# Altium schematic sheet 1_top_sheet.SchDoc
size A
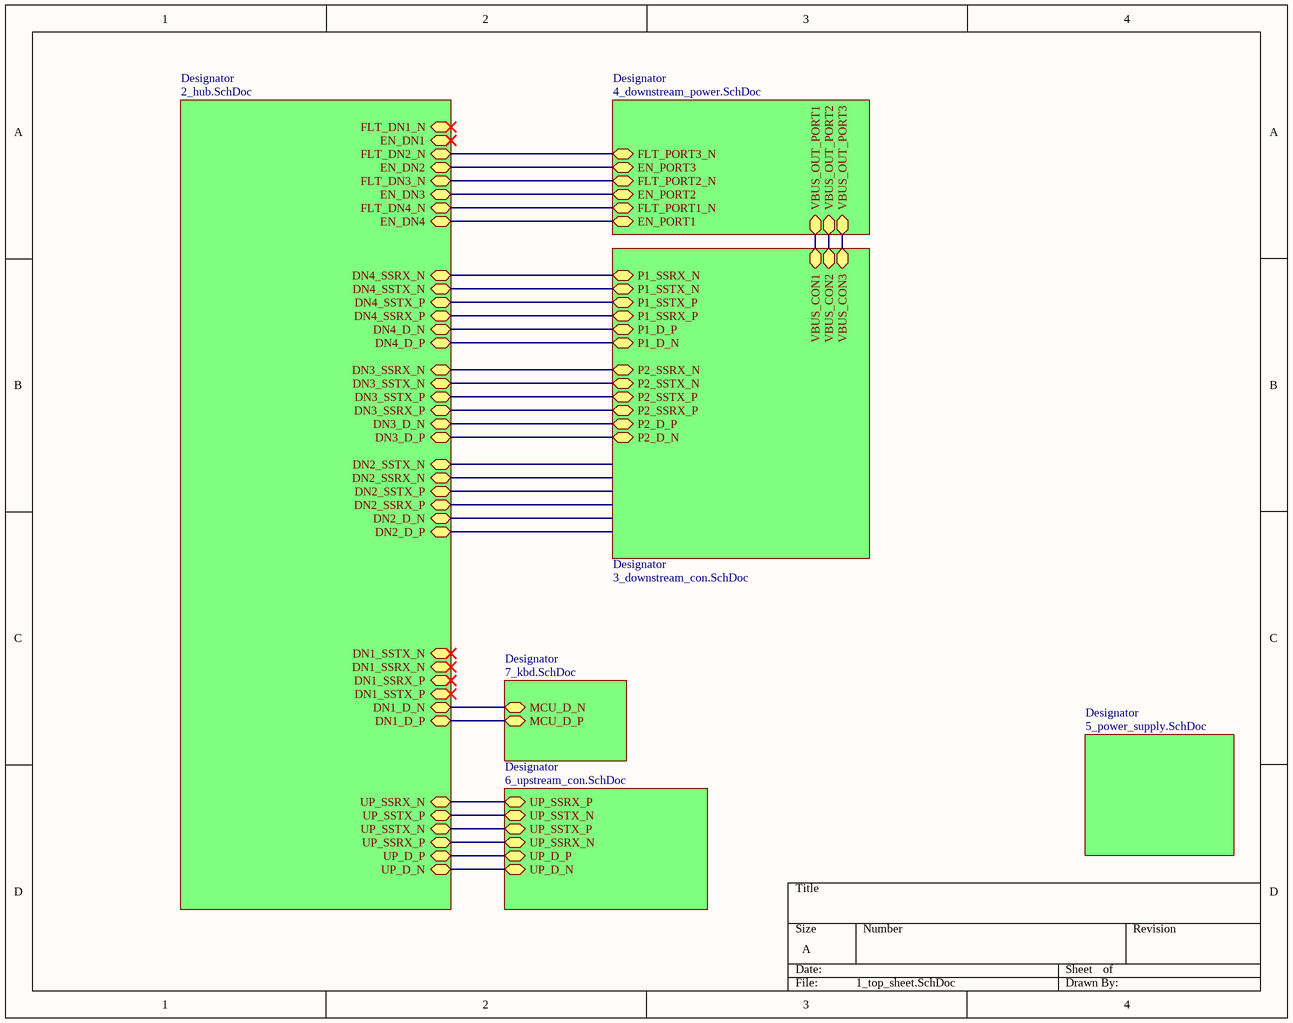
[diagram p0: 1_top_sheet.SchDoc]

## Sub-sheets
Designator = 4_downstream_power.SchDoc: VBUS_OUT_PORT2, FLT_PORT2_N, EN_PORT1, VBUS_OUT_PORT1, FLT_PORT1_N, EN_PORT2, FLT_PORT3_N, VBUS_OUT_PORT3, EN_PORT3
Designator = 2_hub.SchDoc: FLT_DN2_N, EN_DN2, EN_DN3, EN_DN1, FLT_DN3_N, FLT_DN1_N, FLT_DN4_N, EN_DN4, DN4_D_P, DN1_SSRX_N, DN4_D_N, DN4_SSTX_P, DN4_SSTX_N, DN4_SSRX_P, DN4_SSRX_N, UP_SSRX_P, UP_SSRX_N, UP_SSTX_N, UP_SSTX_P, UP_D_N, UP_D_P, DN3_D_P, DN3_SSRX_P, DN3_SSRX_N, DN3_D_N, DN3_SSTX_P, DN3_SSTX_N, DN2_D_P, DN2_D_N, DN2_SSTX_P, DN2_SSTX_N, DN2_SSRX_P, DN2_SSRX_N, DN1_D_P, DN1_D_N, DN1_SSTX_P, DN1_SSTX_N, DN1_SSRX_P
Designator = 3_downstream_con.SchDoc: VBUS_CON1, VBUS_CON2, P2_SSTX_N, P2_SSTX_P, P1_SSTX_N, P1_SSRX_P, P2_SSRX_P, P2_SSRX_N, P1_SSRX_N, P1_D_P, P2_D_N, P2_D_P, P1_SSTX_P, P1_D_N, VBUS_CON3
Designator = 6_upstream_con.SchDoc: UP_SSRX_N, UP_SSTX_N, UP_D_P, UP_D_N, UP_SSRX_P, UP_SSTX_P
Designator = 7_kbd.SchDoc: MCU_D_P, MCU_D_N
Designator = 5_power_supply.SchDoc: no entries

## Nets
(unnamed): sheet Designator/VBUS_OUT_PORT2, sheet Designator/VBUS_CON2
(unnamed): sheet Designator/FLT_PORT2_N, sheet Designator/FLT_DN3_N
(unnamed): sheet Designator/EN_PORT1, sheet Designator/EN_DN4
(unnamed): sheet Designator/VBUS_OUT_PORT1, sheet Designator/VBUS_CON1
(unnamed): sheet Designator/FLT_PORT1_N, sheet Designator/FLT_DN4_N
(unnamed): sheet Designator/EN_PORT2, sheet Designator/EN_DN3
(unnamed): sheet Designator/FLT_PORT3_N, sheet Designator/FLT_DN2_N
(unnamed): sheet Designator/VBUS_OUT_PORT3, sheet Designator/VBUS_CON3
(unnamed): sheet Designator/EN_PORT3, sheet Designator/EN_DN2
(unnamed): sheet Designator/DN4_D_P, sheet Designator/P1_D_N
(unnamed): sheet Designator/DN4_D_N, sheet Designator/P1_D_P
(unnamed): sheet Designator/DN4_SSTX_P, sheet Designator/P1_SSTX_P
(unnamed): sheet Designator/DN4_SSTX_N, sheet Designator/P1_SSTX_N
(unnamed): sheet Designator/DN4_SSRX_P, sheet Designator/P1_SSRX_P
(unnamed): sheet Designator/DN4_SSRX_N, sheet Designator/P1_SSRX_N
(unnamed): sheet Designator/UP_SSRX_P, sheet Designator/UP_SSRX_N
(unnamed): sheet Designator/UP_SSRX_N, sheet Designator/UP_SSRX_P
(unnamed): sheet Designator/UP_SSTX_N, sheet Designator/UP_SSTX_P
(unnamed): sheet Designator/UP_SSTX_P, sheet Designator/UP_SSTX_N
(unnamed): sheet Designator/UP_D_N, sheet Designator/UP_D_N
(unnamed): sheet Designator/UP_D_P, sheet Designator/UP_D_P
(unnamed): sheet Designator/DN3_D_P, sheet Designator/P2_D_N
(unnamed): sheet Designator/DN3_SSRX_P, sheet Designator/P2_SSRX_P
(unnamed): sheet Designator/DN3_SSRX_N, sheet Designator/P2_SSRX_N
(unnamed): sheet Designator/DN3_D_N, sheet Designator/P2_D_P
(unnamed): sheet Designator/DN3_SSTX_P, sheet Designator/P2_SSTX_P
(unnamed): sheet Designator/DN3_SSTX_N, sheet Designator/P2_SSTX_N
(unnamed): sheet Designator/DN1_D_P, sheet Designator/MCU_D_P
(unnamed): sheet Designator/DN1_D_N, sheet Designator/MCU_D_N